# Altium schematic sheet S02-DRIVER.SchDoc
size B; SheetNumber: 3; SheetTotal: 3; BLOCK-TITLE: PWM SIGNAL DRIVER; BLOCK-SIZE: B; BLOCK-PROJECT: MULTIMOD SERVO MODULE; BLOCK-REVISION: 1; BLOCK-ORGANIZATION: UNIVERSITY OF FLORIDA; BLOCK-DESIGNER: MEHRON TALEBI; BLOCK-IDENTIFIER: SUMMER 2023; BLOCK-REVIEWER: MIKE STAPLETON
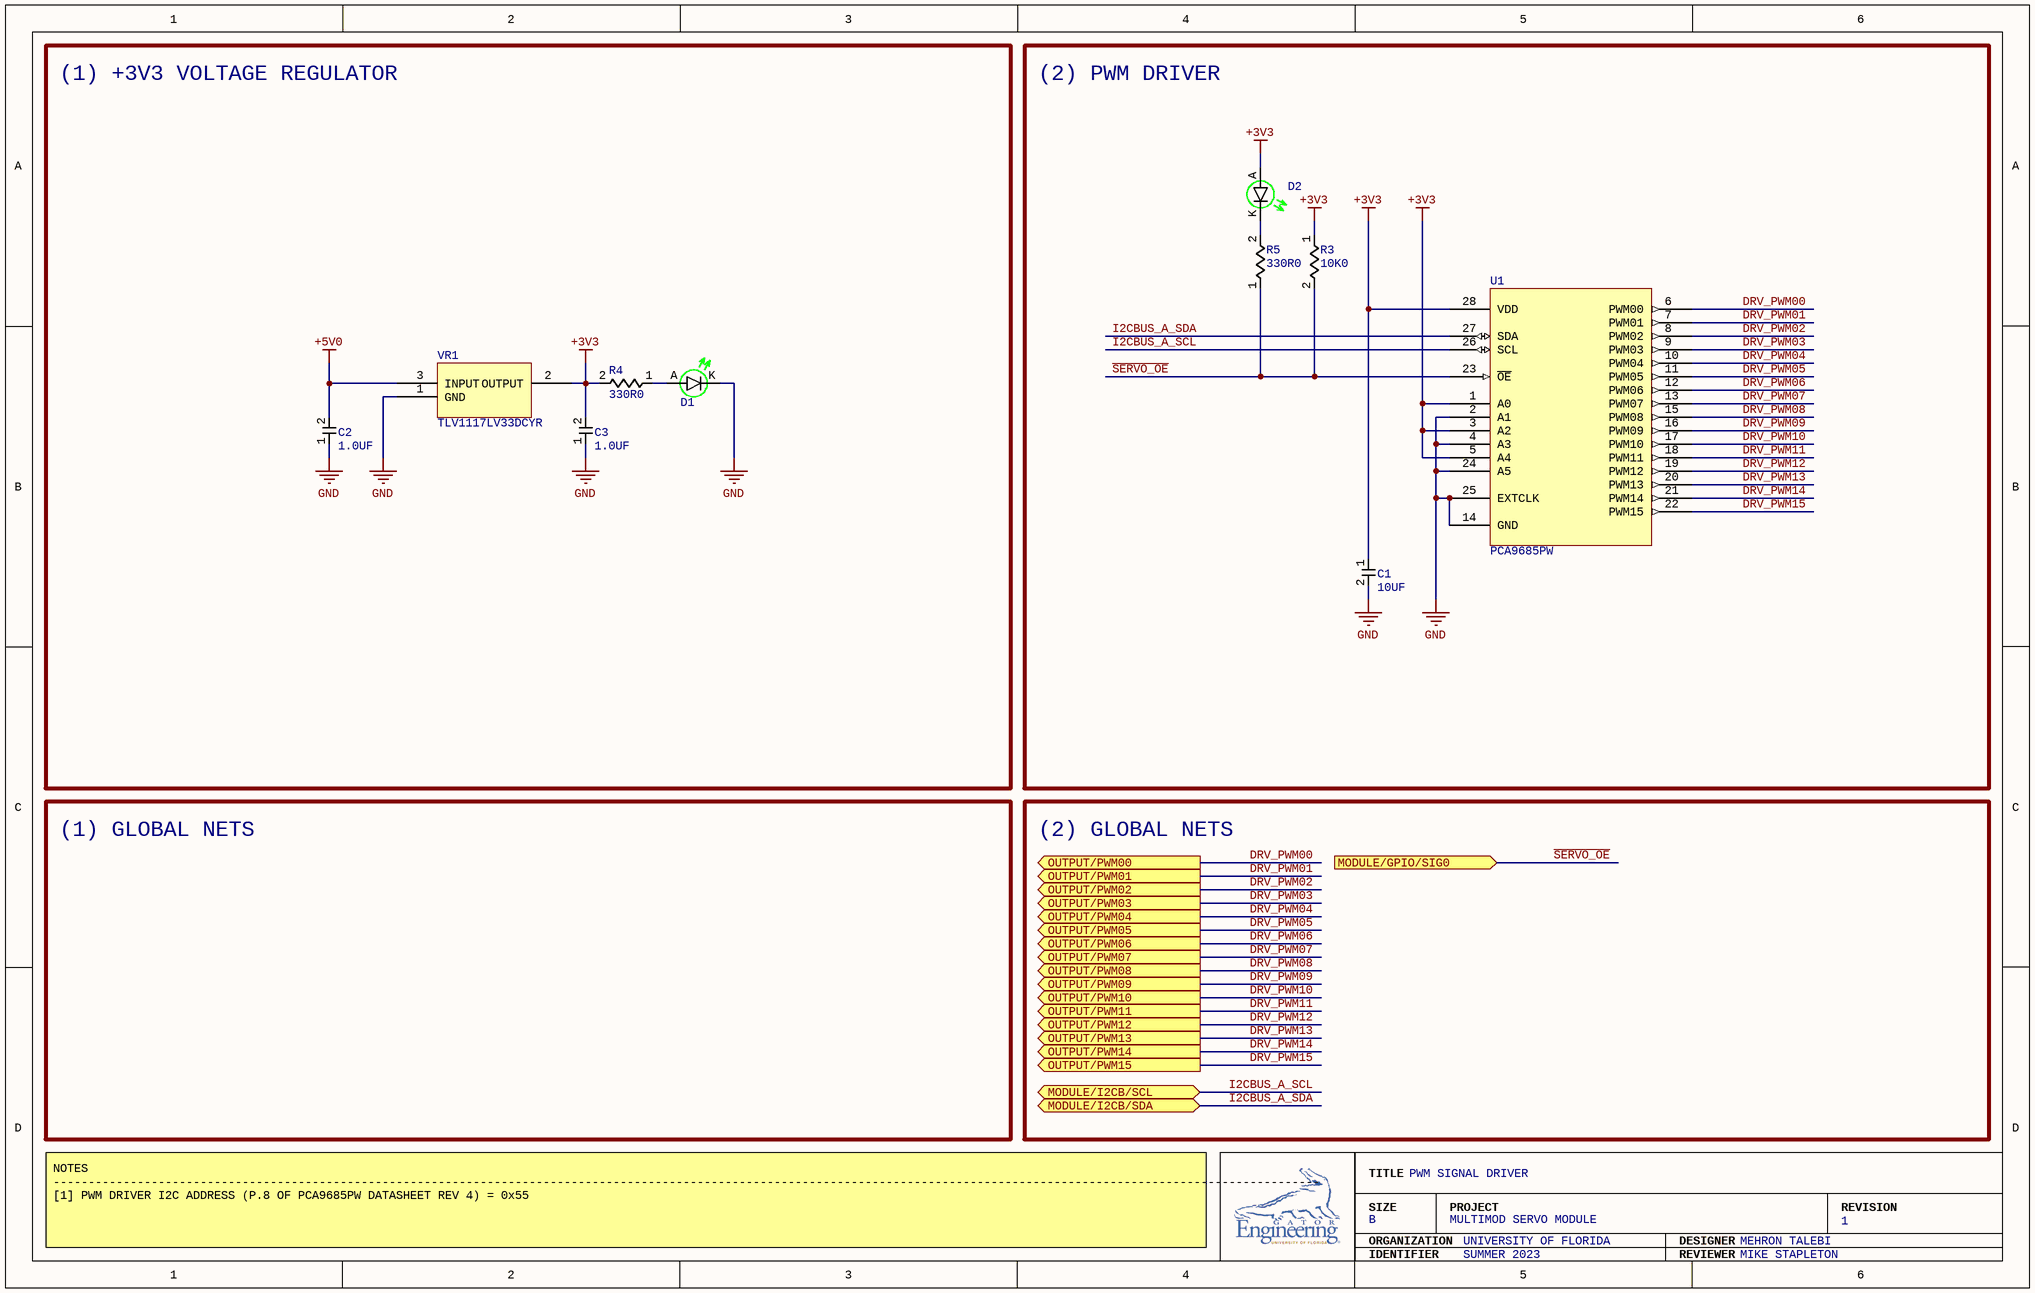
[diagram p0: S02-DRIVER.SchDoc]

## Parts
C1  10UF  [CL21B106KPQNFNE]
C2  1.0UF  [CL21B105KAFNFNE]
C3  1.0UF  [CL21B105KAFNFNE]
D1  LTST-C171GKT  [LTST-C171GKT]  (value not drawn)
D2  LTST-C171GKT  [LTST-C171GKT]  (value not drawn)
R3  10K0  [RC0805FR-0710KL]
R4  330R0  [RC0805FR-7W330RL]
R5  330R0  [RC0805FR-7W330RL]
U1  PCA9685PW  [PCA9685PW]
VR1  TLV1117LV33DCYR  [TLV1117LV33DCYR]

## Blocks framed on the sheet
(1) +3V3 VOLTAGE REGULATOR: C2 C3 D1 R4 VR1
(2) PWM DRIVER: C1 D2 R3 R5 U1

## Ports
MODULE/GPIO/SIG0 (in), MODULE/I2CB/SCL (bidir), MODULE/I2CB/SDA (bidir), OUTPUT/PWM00 (out), OUTPUT/PWM01 (out), OUTPUT/PWM02 (out), OUTPUT/PWM03 (out), OUTPUT/PWM04 (out), OUTPUT/PWM05 (out), OUTPUT/PWM06 (out), OUTPUT/PWM07 (out), OUTPUT/PWM08 (out), OUTPUT/PWM09 (out), OUTPUT/PWM10 (out), OUTPUT/PWM11 (out), OUTPUT/PWM12 (out), OUTPUT/PWM13 (out), OUTPUT/PWM14 (out), OUTPUT/PWM15 (out)

## Nets
+3V3: C1.1 C3.2 D2.A R3.1 R4.2 U1.1(A0) U1.3(A2) U1.5(A4) U1.28(VDD) VR1.2(OUTPUT)
+5V0: C2.2 VR1.3(INPUT)
GND: C1.2 C2.1 C3.1 D1.K U1.2(A1) U1.4(A3) U1.14(GND) U1.24(A5) U1.25(EXTCLK) VR1.1(GND)
~{SERVO_OE}: R3.2 R5.1 U1.23(~{OE}) ; port MODULE/GPIO/SIG0
DRV_PWM00: U1.6(PWM00) ; port OUTPUT/PWM00
DRV_PWM01: U1.7(PWM01) ; port OUTPUT/PWM01
DRV_PWM02: U1.8(PWM02) ; port OUTPUT/PWM02
DRV_PWM03: U1.9(PWM03) ; port OUTPUT/PWM03
DRV_PWM04: U1.10(PWM04) ; port OUTPUT/PWM04
DRV_PWM05: U1.11(PWM05) ; port OUTPUT/PWM05
DRV_PWM06: U1.12(PWM06) ; port OUTPUT/PWM06
DRV_PWM07: U1.13(PWM07) ; port OUTPUT/PWM07
DRV_PWM08: U1.15(PWM08) ; port OUTPUT/PWM08
DRV_PWM09: U1.16(PWM09) ; port OUTPUT/PWM09
DRV_PWM10: U1.17(PWM10) ; port OUTPUT/PWM10
DRV_PWM11: U1.18(PWM11) ; port OUTPUT/PWM11
DRV_PWM12: U1.19(PWM12) ; port OUTPUT/PWM12
DRV_PWM13: U1.20(PWM13) ; port OUTPUT/PWM13
DRV_PWM14: U1.21(PWM14) ; port OUTPUT/PWM14
DRV_PWM15: U1.22(PWM15) ; port OUTPUT/PWM15
I2CBUS_A_SCL: U1.26(SCL) ; port MODULE/I2CB/SCL
I2CBUS_A_SDA: U1.27(SDA) ; port MODULE/I2CB/SDA
NetD1_A: D1.A R4.1
NetD2_K: D2.K R5.2

## Notes on the sheet
- (1) GLOBAL NETS
- (2) GLOBAL NETS
- NOTES
  -------------------------------------------------------------------------------------------------------------------------------------------------------------------------------------
  [1] PWM DRIVER I2C ADDRESS (P.8 OF PCA9685PW DATASHEET REV 4) = 0x55
- TITLE
- SIZE
- ORGANIZATION
- PROJECT
- DESIGNER
- REVISION
- IDENTIFIER
- REVIEWER

## Library data of the parts
C1 = CL21B106KPQNFNE: CAP CER 10UF 10V X7R 0805; Capacitance: 10 µF; Tolerance: ±10%; Voltage - Rated: 10V; Temperature Coefficient: X7R; Operating Temperature: -55°C ~ 125°C; Applications: General Purpose; Mounting Type: Surface Mount, MLCC; Package / Case: 0805 (2012 Metric); Size / Dimension: 0.079" L x 0.049" W (2.00mm x 1.25mm); Thickness (Max): 0.053" (1.35mm); Supplier 1: Arrow Electronics; Supplier Part Number 1: CL21B106KPQNFNE
C2 C3 = CL21B105KAFNFNE: CAP CER 1UF 25V X7R 0805; Capacitance: 1 µF; Tolerance: ±10%; Voltage - Rated: 25V; Temperature Coefficient: X7R; Operating Temperature: -55°C ~ 125°C; Applications: General Purpose; Mounting Type: Surface Mount, MLCC; Package / Case: 0805 (2012 Metric); Size / Dimension: 0.079" L x 0.049" W (2.00mm x 1.25mm); Thickness (Max): 0.053" (1.35mm); Supplier 1: Arrow Electronics; Supplier Part Number 1: CL21B105KAFNFNE
D1 D2 = LTST-C171GKT: LED GREEN CLEAR CHIP SMD; Configuration: Standard; Lens Color: Colorless; Millicandela Rating: 12mcd; Lens Style: Rectangle with Flat Top; Lens Size: 1.40mm x 1.25mm; Voltage - Forward (Vf) (Typ): 2.1V; Current - Test: 20mA; Viewing Angle: 130°; Wavelength - Dominant: 569nm; Wavelength - Peak: 565nm; Color: Green; Lens Transparency: Clear; Mounting Type: Surface Mount; Package / Case: 0805 (2012 Metric); Supplier Device Package: Chip LED; Size / Dimension: 2.00mm L x 1.25mm W; Height (Max): 0.90mm; Supplier 1: Digi-Key; Supplier Part Number 1: 160-1423-1-ND
R3 = RC0805FR-0710KL: RES 10K OHM 1% 1/8W 0805; Resistance: 10 kOhms; Power (Watts): 0.125W, 1/8W; Temperature Coefficient: ±100ppm/°C; Tolerance: ±1%; Composition: Thick Film; Features: Moisture Resistant; Operating Temperature: -55°C ~ 155°C; Package / Case: 0805 (2012 Metric); Supplier Device Package: 0805; Size / Dimension: 0.079" L x 0.049" W (2.00mm x 1.25mm); Height - Seated (Max): 0.024" (0.60mm); Number of Terminations: 2; Supplier 1: Future Electronics; Supplier Part Number 1: 3310877
R4 R5 = RC0805FR-7W330RL: RES 330 OHM 1% 1/4W 0805; Resistance: 330 Ohms; Power (Watts): 0.25W, 1/4W; Temperature Coefficient: ±100ppm/°C; Tolerance: ±1%; Composition: Thick Film; Features: Moisture Resistant; Operating Temperature: -55°C ~ 155°C; Supplier Device Package: 0805; Size / Dimension: 0.079" L x 0.049" W (2.00mm x 1.25mm); Height - Seated (Max): 0.024" (0.60mm); Number of Terminations: 2; Supplier 1: Mouser; Supplier Part Number 1: 603-RC0805FR-7W330RL
U1 = PCA9685PW: IC LED DRVR LIN PWM 25MA 28TSSOP; Internal Switch(s): Yes; Number of Outputs: 16; Voltage - Supply (Min): 2.3V; Voltage - Supply (Max): 5.5V; Frequency: 100kHz ~ 1MHz; Type: Linear; Voltage - Output: 5.5V; Current - Output / Channel: 25mA; Dimming: PWM; Applications: Backlight; Operating Temperature: -40°C ~ 85°C (TA); Mounting Type: Surface Mount; Package / Case: 28-TSSOP (0.173", 4.40mm Width); Supplier 1: Arrow Electronics; Supplier Part Number 1: PCA9685PW,118
VR1 = TLV1117LV33DCYR: IC REG LINEAR 3.3V 1A SOT223-4; Output Configuration: Positive; Output Type: Fixed; Number of Regulators: 1; Voltage - Input (Max): 5.5V; Voltage Dropout (Max): 1.3V @ 800mA; Current - Quiescent (Iq): 100 µA; PSRR: 75dB (120Hz); Protection Features: Over Current, Over Temperature; Voltage - Output (Min/Fixed): 3.3V; Current - Output: 1A; Operating Temperature: -40°C ~ 125°C; Mounting Type: Surface Mount; Package / Case: TO-261-4, TO-261AA; ComponentLink1Description: Datasheet; ComponentLink1URL: https://www.ti.com/lit/ds/symlink/tlv1117lv.pdf; Supplier 1: Digi-Key; Supplier Part Number 1: 296-28778-1-ND